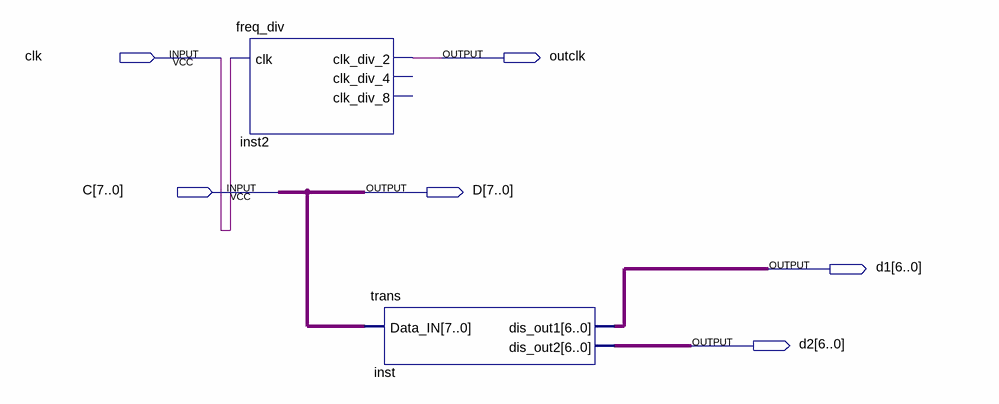
[diagram p0: schematic sheet]
// Quartus schematic top.bdf as structural Verilog: 2 symbols, 6 pins
module top (
  input  clk,
  input  [7:0] C,
  output outclk,
  output [7:0] D,
  output [6:0] d1,
  output [6:0] d2
);

  freq_div inst2 (.clk(clk), .clk_div_2(outclk));  // open: clk_div_4, clk_div_8
  trans inst (.Data_IN(C), .dis_out1(d1), .dis_out2(d2));

  assign D = C;
endmodule
